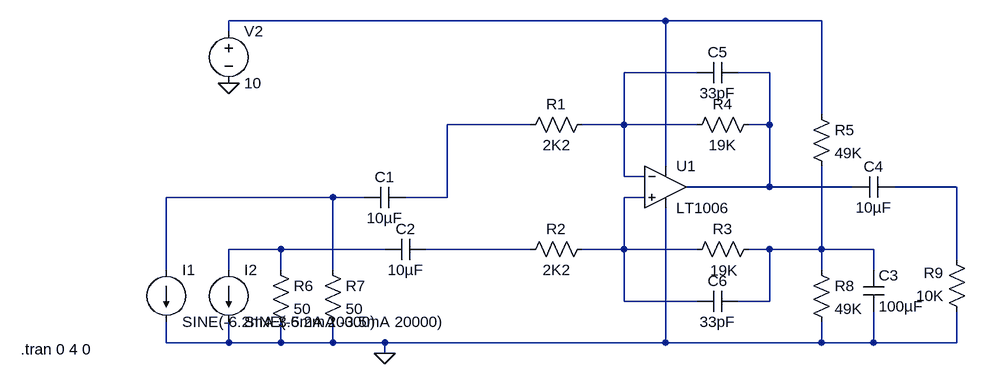
[diagram p0: schematic Draft13.asc]
Draft13.asc, the LTspice schematic file:
Version 4
SHEET 1 1028 680
WIRE 560 -160 -112 -160
WIRE 800 -160 560 -160
WIRE -112 -144 -112 -160
WIRE 608 -80 496 -80
WIRE 720 -80 672 -80
WIRE 800 -16 800 -160
WIRE 352 0 224 0
WIRE 496 0 496 -80
WIRE 496 0 432 0
WIRE 608 0 496 0
WIRE 720 0 720 -80
WIRE 720 0 688 0
WIRE 560 64 560 -160
WIRE 496 80 496 0
WIRE 528 80 496 80
WIRE 720 96 720 0
WIRE 720 96 592 96
WIRE 848 96 720 96
WIRE 1008 96 912 96
WIRE 48 112 -208 112
WIRE 96 112 48 112
WIRE 224 112 224 0
WIRE 224 112 160 112
WIRE 528 112 496 112
WIRE -32 192 -112 192
WIRE 128 192 -32 192
WIRE 352 192 192 192
WIRE 496 192 496 112
WIRE 496 192 432 192
WIRE 608 192 496 192
WIRE 720 192 688 192
WIRE 800 192 800 64
WIRE 800 192 720 192
WIRE 880 192 800 192
WIRE 1008 208 1008 96
WIRE -208 224 -208 112
WIRE -112 224 -112 192
WIRE -32 224 -32 192
WIRE 48 224 48 112
WIRE 800 224 800 192
WIRE 880 224 880 192
WIRE 496 272 496 192
WIRE 608 272 496 272
WIRE 720 272 720 192
WIRE 720 272 672 272
WIRE -208 336 -208 304
WIRE -112 336 -112 304
WIRE -112 336 -208 336
WIRE -32 336 -32 304
WIRE -32 336 -112 336
WIRE 48 336 48 304
WIRE 48 336 -32 336
WIRE 128 336 48 336
WIRE 560 336 560 128
WIRE 560 336 128 336
WIRE 800 336 800 304
WIRE 800 336 560 336
WIRE 880 336 880 288
WIRE 880 336 800 336
WIRE 1008 336 1008 288
WIRE 1008 336 880 336
WIRE 128 352 128 336
FLAG -112 -64 0
FLAG 128 352 0
SYMBOL voltage -112 -160 R0
WINDOW 123 0 0 Left 2
WINDOW 39 0 0 Left 2
SYMATTR InstName V2
SYMATTR Value 10
SYMBOL res -48 208 R0
SYMATTR InstName R6
SYMATTR Value 50
SYMBOL res 32 208 R0
SYMATTR InstName R7
SYMATTR Value 50
SYMBOL current -208 224 R0
WINDOW 123 0 0 Left 2
WINDOW 39 0 0 Left 2
SYMATTR InstName I1
SYMATTR Value SINE(-6.2mA 3.5mA 20000)
SYMBOL current -112 224 R0
WINDOW 123 0 0 Left 2
WINDOW 39 0 0 Left 2
SYMATTR InstName I2
SYMATTR Value SINE(-6.2mA -3.5mA 20000)
SYMBOL cap 160 96 R90
WINDOW 0 0 32 VBottom 2
WINDOW 3 32 32 VTop 2
SYMATTR InstName C1
SYMATTR Value 10µF
SYMBOL cap 192 176 R90
WINDOW 0 0 32 VBottom 2
WINDOW 3 32 32 VTop 2
SYMATTR InstName C2
SYMATTR Value 10µF
SYMBOL Opamps\\LT1006 560 32 R0
SYMATTR InstName U1
SYMBOL res 448 -16 R90
WINDOW 0 0 56 VBottom 2
WINDOW 3 32 56 VTop 2
SYMATTR InstName R1
SYMATTR Value 2K2
SYMBOL res 448 176 R90
WINDOW 0 0 56 VBottom 2
WINDOW 3 32 56 VTop 2
SYMATTR InstName R2
SYMATTR Value 2K2
SYMBOL res 704 176 R90
WINDOW 0 0 56 VBottom 2
WINDOW 3 33 54 VTop 2
SYMATTR InstName R3
SYMATTR Value 19K
SYMBOL res 704 -16 R90
WINDOW 0 0 56 VBottom 2
WINDOW 3 32 56 VTop 2
SYMATTR InstName R4
SYMATTR Value 19K
SYMBOL res 784 -32 R0
SYMATTR InstName R5
SYMATTR Value 49K
SYMBOL res 784 208 R0
SYMATTR InstName R8
SYMATTR Value 49K
SYMBOL cap 864 224 R0
SYMATTR InstName C3
SYMATTR Value 100µF
SYMBOL cap 912 80 R90
WINDOW 0 0 32 VBottom 2
WINDOW 3 32 32 VTop 2
SYMATTR InstName C4
SYMATTR Value 10µF
SYMBOL res 1024 304 R180
WINDOW 0 36 76 Left 2
WINDOW 3 36 40 Left 2
SYMATTR InstName R9
SYMATTR Value 10K
SYMBOL cap 672 -96 R90
WINDOW 0 0 32 VBottom 2
WINDOW 3 32 32 VTop 2
SYMATTR InstName C5
SYMATTR Value 33pF
SYMBOL cap 672 256 R90
WINDOW 0 0 32 VBottom 2
WINDOW 3 32 32 VTop 2
SYMATTR InstName C6
SYMATTR Value 33pF
TEXT -432 346 Left 2 !.tran 0 4 0

The netlist it stands for:
* Draft13.asc
V2 N001 0 10
R6 N008 0 50
R7 N006 0 50
I1 N006 0 SINE(-6.2mA 3.5mA 20000)
I2 N008 0 SINE(-6.2mA -3.5mA 20000)
C1 N004 N006 10µF
C2 N009 N008 10µF
XU1 N007 N002 N001 0 N003 LT1006  ; pins In+ In- V+ V- OUT
R1 N002 N004 2K2
R2 N007 N009 2K2
R3 N010 N007 19K
R4 N003 N002 19K
R5 N001 N010 49K
R8 N010 0 49K
C3 N010 0 100µF
C4 N005 N003 10µF
R9 0 N005 10K
C5 N003 N002 33pF
C6 N010 N007 33pF
.tran 0 4 0
.lib LTC.lib
.backanno
.end